# Altium project Keyboard_Bottom.PrjPcb
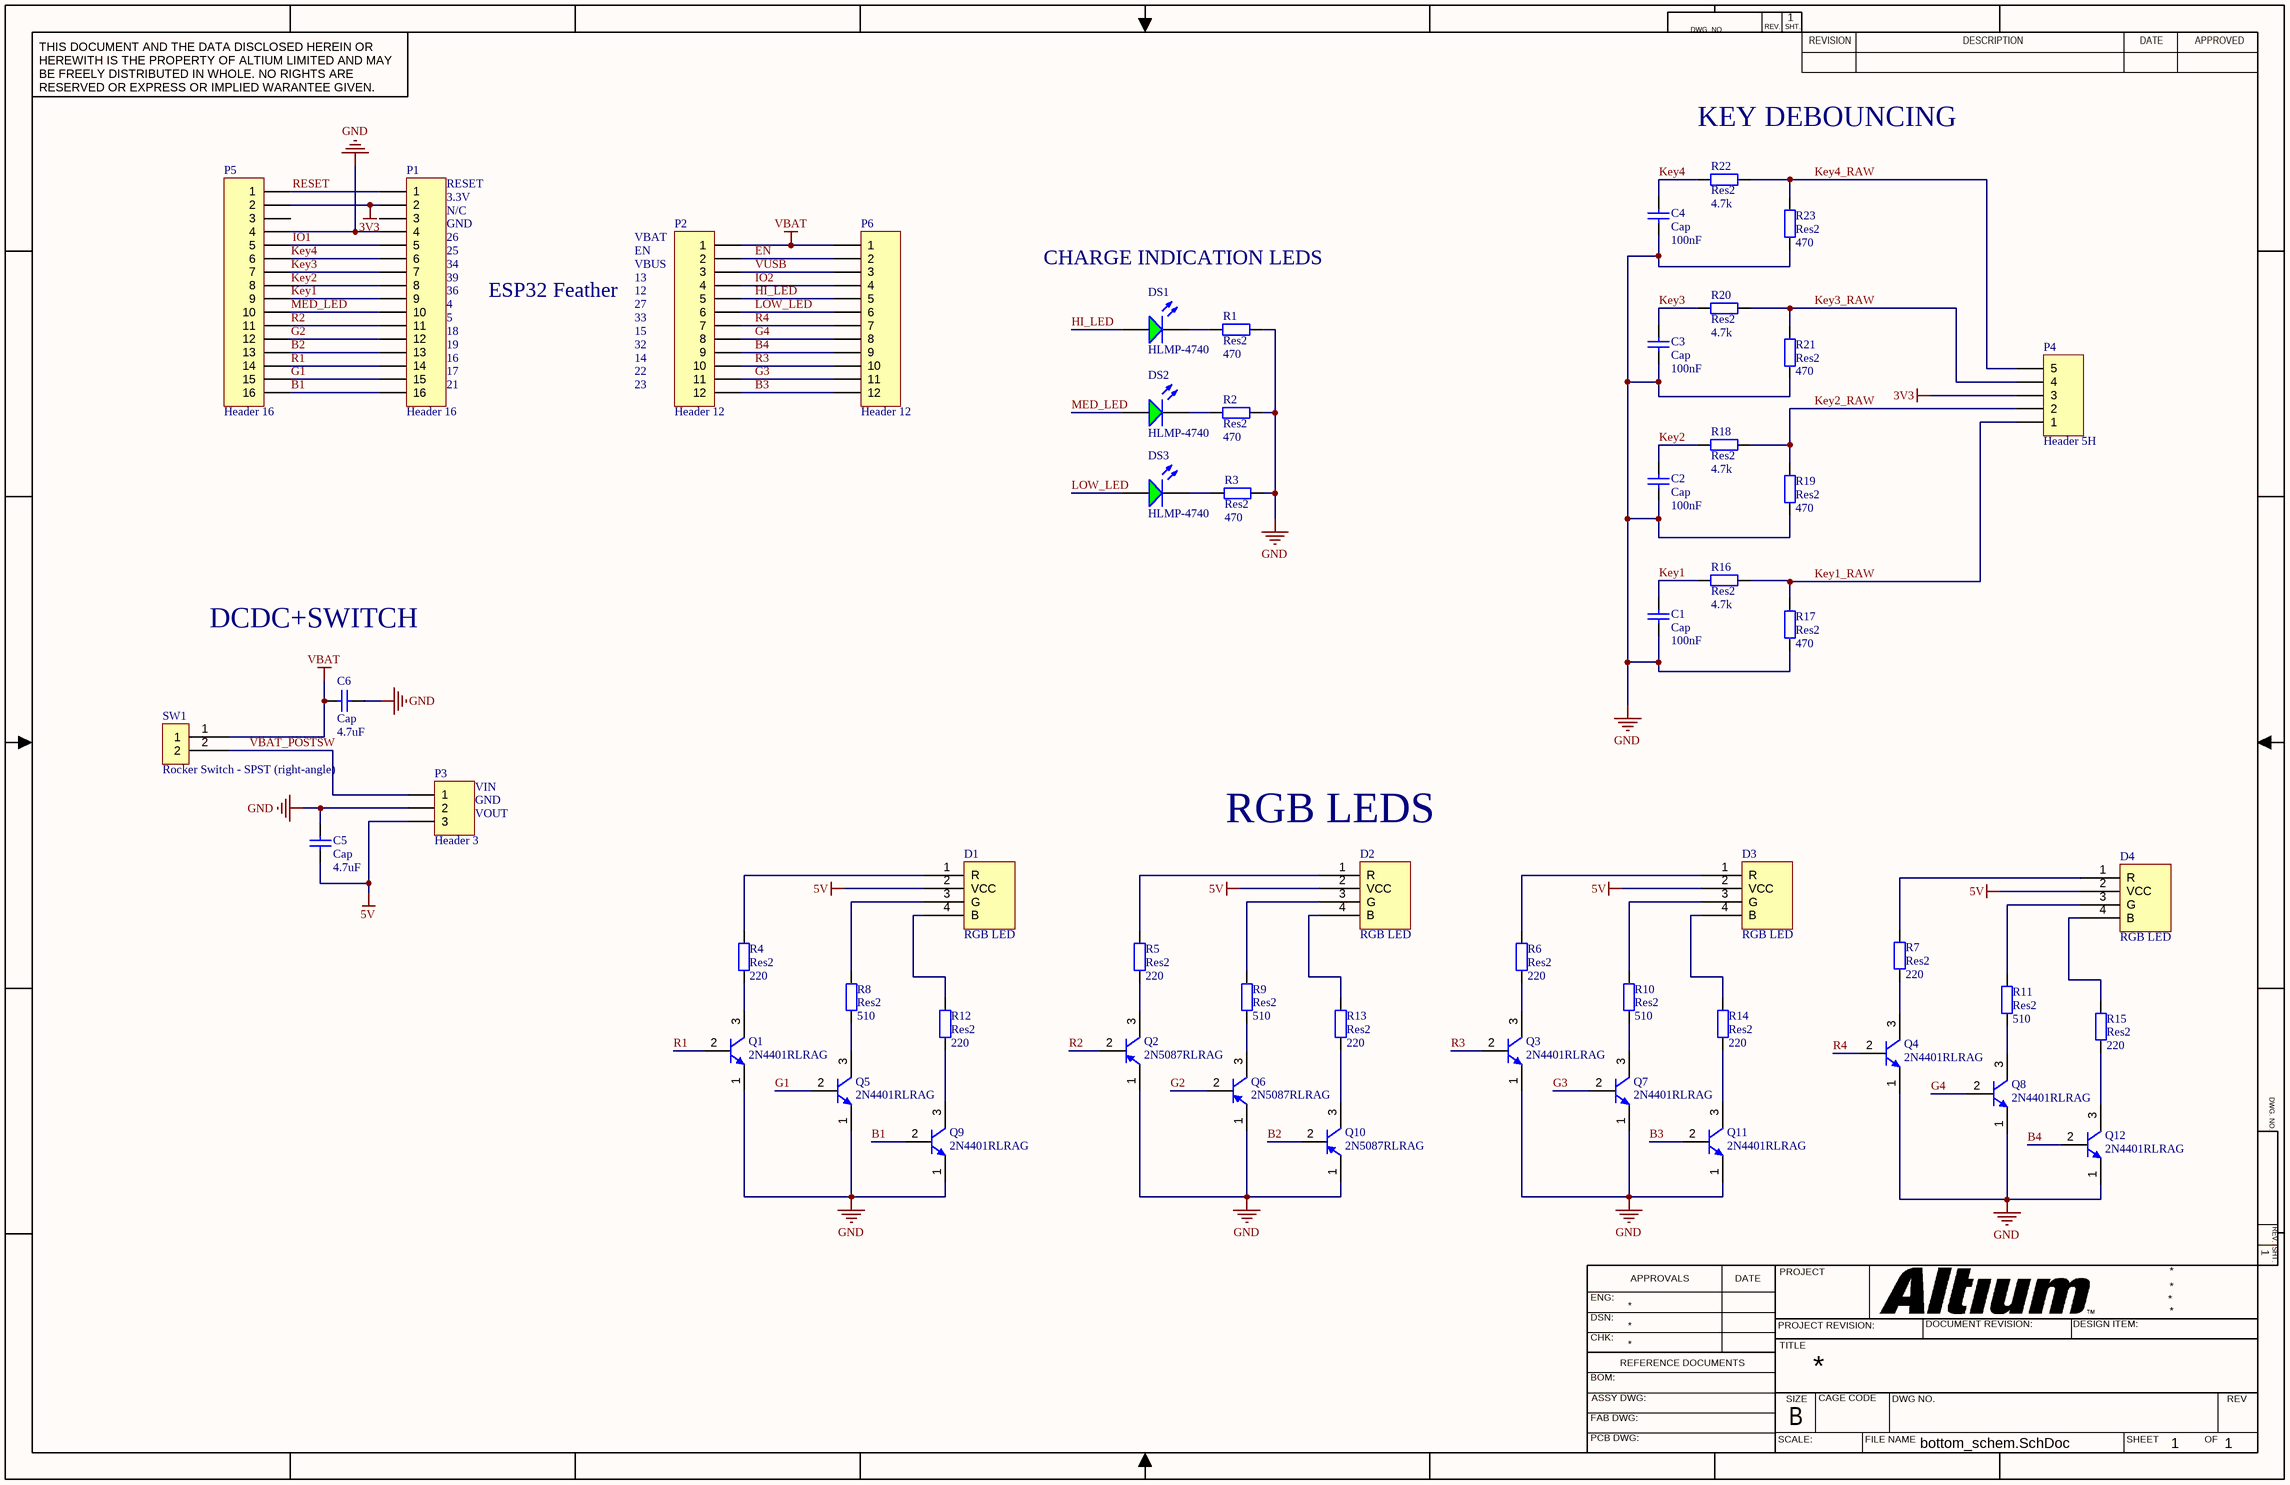
[diagram p0: bottom_schem.SchDoc]
1 sheet, 55 parts. Net scope: global (net labels, ports and power ports of the same name join across sheets).
Board file: bottom_pcb.PcbDoc

## Sheet bottom_schem.SchDoc
size 431 x 279 mm; SheetNumber: 1; SheetTotal: 1; SPICEModelCacheWXNTTEOF: <root> / <DocumentId>WXNTTEOF</DocumentId> / <CacheFrame Number="0"> / <Model Name="led1" Kind="MDL"> / <Text>*Typ RED GaAs LED: Vf=1.7V Vr=4V If=40mA trr=3uS / *LED Pinout: 1=A, 2=K / .MODEL LED1 D (IS=93.2P RS=42M N=3.73 BV=4 IBV=10U / + CJO=2.97P VJ=.75 M=.333 TT=4.32U)</Text> / </Model> / <Model Name="cap" Kind="MDL"> / <Text>*Default semiconductor capacitor / .MODEL CAP C()</Text> / </Model> / </CacheFrame> / </root>

### Parts
C1  Cap  value 100nF  [RAD-0.3]
C2  Cap  value 100nF  [RAD-0.3]
C3  Cap  value 100nF  [RAD-0.3]
C4  Cap  value 100nF  [RAD-0.3]
C5  Cap  value 4.7uF  [RAD-0.3]
C6  Cap  value 4.7uF  [RAD-0.3]
D1  RGB LED  [New footprint 1]
D2  RGB LED  [New footprint 1]
D3  RGB LED  [New footprint 1]
D4  RGB LED  [New footprint 1]
DS1  HLMP-4740  [AVAG-HLMP-4740]
DS2  HLMP-4740  [AVAG-HLMP-4740]
DS3  HLMP-4740  [AVAG-HLMP-4740]
P1  Header 16  [HDR1X16]
P2  Header 12  [HDR1X12]
P3  Header 3  [HDR1X3]
P4  Header 5H  [HDR1X5H]
P5  Header 16  [HDR1X16]
P6  Header 12  [HDR1X12]
Q1  2N4401RLRAG  [ONSC-TO-92-3-29-11_AM_BL]
Q2  2N5087RLRAG  [ONSC-TO-92-3-29-11_AM_BL]
Q3  2N4401RLRAG  [ONSC-TO-92-3-29-11_AM_BL]
Q4  2N4401RLRAG  [ONSC-TO-92-3-29-11_AM_BL]
Q5  2N4401RLRAG  [ONSC-TO-92-3-29-11_AM_BL]
Q6  2N5087RLRAG  [ONSC-TO-92-3-29-11_AM_BL]
Q7  2N4401RLRAG  [ONSC-TO-92-3-29-11_AM_BL]
Q8  2N4401RLRAG  [ONSC-TO-92-3-29-11_AM_BL]
Q9  2N4401RLRAG  [ONSC-TO-92-3-29-11_AM_BL]
Q10  2N5087RLRAG  [ONSC-TO-92-3-29-11_AM_BL]
Q11  2N4401RLRAG  [ONSC-TO-92-3-29-11_AM_BL]
Q12  2N4401RLRAG  [ONSC-TO-92-3-29-11_AM_BL]
R1  Res2  value 470  [AXIAL-0.4]
R2  Res2  value 470  [AXIAL-0.4]
R3  Res2  value 470  [AXIAL-0.4]
R4  Res2  value 220  [AXIAL-0.4]
R5  Res2  value 220  [AXIAL-0.4]
R6  Res2  value 220  [AXIAL-0.4]
R7  Res2  value 220  [AXIAL-0.4]
R8  Res2  value 510  [AXIAL-0.4]
R9  Res2  value 510  [AXIAL-0.4]
R10  Res2  value 510  [AXIAL-0.4]
R11  Res2  value 510  [AXIAL-0.4]
R12  Res2  value 220  [AXIAL-0.4]
R13  Res2  value 220  [AXIAL-0.4]
R14  Res2  value 220  [AXIAL-0.4]
R15  Res2  value 220  [AXIAL-0.4]
R16  Res2  value 4.7k  [AXIAL-0.4]
R17  Res2  value 470  [AXIAL-0.4]
R18  Res2  value 4.7k  [AXIAL-0.4]
R19  Res2  value 470  [AXIAL-0.4]
R20  Res2  value 4.7k  [AXIAL-0.4]
R21  Res2  value 470  [AXIAL-0.4]
R22  Res2  value 4.7k  [AXIAL-0.4]
R23  Res2  value 470  [AXIAL-0.4]
SW1  Rocker Switch - SPST (right-angle)  [Rocker Switch - SPST (right-angle)-Footprint-1]

### Nets
3V3: P1.2 P4.3 P5.2
5V: C5.2 D1.2(VCC) D2.2(VCC) D3.2(VCC) D4.2(VCC) P3.3
GND: C1.2 C2.2 C3.2 C4.2 C5.1 C6.2 P1.4 P3.2 P5.4 Q1.1(E) Q2.1(E) Q3.1(E) Q4.1(E) Q5.1(E) Q6.1(E) Q7.1(E) Q8.1(E) Q9.1(E) Q10.1(E) Q11.1(E) Q12.1(E) R1.1 R2.1 R3.1 R17.1 R19.1 R21.1 R23.1
VBAT: C6.1 P2.1 P6.1 SW1.1
B1: P1.16 P5.16 Q9.2(B)
B2: P1.13 P5.13 Q10.2(B)
B3: P2.12 P6.12 Q11.2(B)
B4: P2.9 P6.9 Q12.2(B)
EN: P2.2 P6.2
G1: P1.15 P5.15 Q5.2(B)
G2: P1.12 P5.12 Q6.2(B)
G3: P2.11 P6.11 Q7.2(B)
G4: P2.8 P6.8 Q8.2(B)
HI_LED: DS1.1(A) P2.5 P6.5
IO1: P1.5 P5.5
IO2: P2.4 P6.4
Key1: C1.1 P1.9 P5.9 R16.2
Key1_RAW: P4.1 R16.1 R17.2
Key2: C2.1 P1.8 P5.8 R18.2
Key2_RAW: P4.2 R18.1 R19.2
Key3: C3.1 P1.7 P5.7 R20.2
Key3_RAW: P4.4 R20.1 R21.2
Key4: C4.1 P1.6 P5.6 R22.2
Key4_RAW: P4.5 R22.1 R23.2
LOW_LED: DS3.1(A) P2.6 P6.6
MED_LED: DS2.1(A) P1.10 P5.10
R1: P1.14 P5.14 Q1.2(B)
R2: P1.11 P5.11 Q2.2(B)
R3: P2.10 P6.10 Q3.2(B)
R4: P2.7 P6.7 Q4.2(B)
RESET: P1.1 P5.1
VBAT_POSTSW: P3.1 SW1.2
VUSB: P2.3 P6.3
NetD1_1: D1.1(R) R4.2
NetD1_3: D1.3(G) R8.2
NetD1_4: D1.4(B) R12.2
NetD2_1: D2.1(R) R5.2
NetD2_3: D2.3(G) R9.2
NetD2_4: D2.4(B) R13.2
NetD3_1: D3.1(R) R6.2
NetD3_3: D3.3(G) R10.2
NetD3_4: D3.4(B) R14.2
NetD4_1: D4.1(R) R7.2
NetD4_3: D4.3(G) R11.2
NetD4_4: D4.4(B) R15.2
NetDS1_2: DS1.2(K) R1.2
NetDS2_2: DS2.2(K) R2.2
NetDS3_2: DS3.2(K) R3.2
NetQ1_3: Q1.3(C) R4.1
NetQ2_3: Q2.3(C) R5.1
NetQ3_3: Q3.3(C) R6.1
NetQ4_3: Q4.3(C) R7.1
NetQ5_3: Q5.3(C) R8.1
NetQ6_3: Q6.3(C) R9.1
NetQ7_3: Q7.3(C) R10.1
NetQ8_3: Q8.3(C) R11.1
NetQ9_3: Q9.3(C) R12.1
NetQ10_3: Q10.3(C) R13.1
NetQ11_3: Q11.3(C) R14.1
NetQ12_3: Q12.3(C) R15.1

Not connected (* = marked no-connect by the designer): P1 3; P5 3

### Notes on the sheet
- (near R22) KEY DEBOUNCING
- (near P1) RESET
- (near P1) 3.3V
- (near P1) N/C
- (near P1) GND
- (near P1) 26
- (near P1) 25
- (near P1) 34
- (near P1) 39
- (near P1) 36
- ESP32 Feather
- VBAT
- EN
- VBUS
- 13
- 12
- CHARGE INDICATION LEDS
- (near P1) 4
- (near P1) 5
- (near P1) 18
- (near P1) 19
- (near P1) 16
- 27
- 33
- 15
- 32
- 14
- (near P1) 17
- (near P1) 21
- 22
- 23
- DCDC+SWITCH
- (near P3) VIN
- (near P3) GND
- (near P3) VOUT
- (near D2) RGB LEDS
- DWG. NO.
- REV.
- SHT.
- THIS DOCUMENT AND THE DATA DISCLOSED HEREIN OR HEREWITH IS THE PROPERTY OF ALTIUM LIMITED AND MAY BE FREELY DISTRIBUTED IN WHOLE. NO RIGHTS ARE RESERVED OR EXPRESS OR IMPLIED WARANTEE GIVEN.
- REVISION
- DESCRIPTION
- DATE
- APPROVED
- ENG:
- APPROVALS
- PROJECT
- DSN:
- CHK:
- REFERENCE DOCUMENTS
- PROJECT REVISION:
- TITLE
- DOCUMENT REVISION:
- DESIGN ITEM:
- BOM:
- FAB DWG:
- PCB DWG:
- ASSY DWG:
- SCALE:
- SIZE
- B
- CAGE CODE
- FILE NAME
- DWG NO.
- SHEET
- OF
- REV

### Library data of the parts
C1-C6 = Cap: Capacitor; Published: 8-Jun-2000; LatestRevisionDate: 17-Jul-2002; LatestRevisionNote: Re-released for DXP Platform.; PackageReference: RAD-0.3; Publisher: Altium Limited; PackageDescription: Radial Cap, Thru-Hole; 2 Leads; 0.3 in Pin Spacing
D1-D4 = CMP-007-00036-1: 4-pin common anode RGB LED
DS1-DS3 = CMP-2000-06413-1: T-1 3/4 (5 mm) Low Current LED Lamp, Green, 1.9 V, -20 to 100 degC, 2-Pin THD, RoHS, Bulk; Manufacturer: AvagoTechnologies; Type: Uni-Color; Peak Wavelength: 565nm; Rad Hard: No; Viewing Angle: 50°; Dominant Wavelength/Color Temperature: 569nm; Number of LEDs: 1; Lens Appearance: ColoredDiffused; Lens Shape Type: Circular; Mounting Orientation: TopMount; Intensity: 2.3mcd; Datasheet Version: 07/2014; Category: LEDs; Datasheet URL: http://docs.avagotech.com/docs/AV02-1557EN; Packaging: Bulk; Pin Count: 2; Mounting Technology: ThroughHole; Package Reference: HLMP-4740; Mounting: ThroughHole; Manufacturer URL: http://www.avagotech.com/; Color: Green; Package: 2T-13/4; Package Description: 2-Pin Through Hole Device, Dia 5.845 mm, Pitch 2.54 mm
P1 P5 = Header 16: Header, 16-Pin; LatestRevisionDate: 17-Jul-2002; LatestRevisionNote: Re-released for DXP Platform.; Publisher: Altium Limited
P2 P6 = Header 12: Header, 12-Pin; LatestRevisionDate: 17-Jul-2002; LatestRevisionNote: Re-released for DXP Platform.; Publisher: Altium Limited
P3 = Header 3: Header, 3-Pin; LatestRevisionDate: 17-Jul-2002; LatestRevisionNote: Re-released for DXP Platform.; Publisher: Altium Limited
P4 = Header 5H: Header, 5-Pin, Right Angle; LatestRevisionDate: 17-Jul-2002; LatestRevisionNote: Re-released for DXP Platform.; Publisher: Altium Limited
Q1 Q3-Q5 Q7-Q9 Q11 Q12 = CMP-1048-01482-1: General Purpose Transistor, NPN Silicon, 3-Pin TO-92, Pb-Free, Tape and Reel; Manufacturer: On Semiconductor; IC Continuous (A): 0.6; fT Min (MHz): 250; PackageDescription: 3-Pin Transistor Outline, Body 4.825 x 3.685 mm, Pitch 1.27 mm; ComponentLink1Description: Manufacturer URL; Packing: Tape and Reel; ComponentLink1URL: http://www.onsemi.com/; PackageVersion: Rev. AM; ComponentLink3URL: http://www.onsemi.com/pub_link/Collateral/MAC97-D.PDF; PackageReference: TO-92-3-29-11_AM_BL; ComponentLink3Description: Package Specification; DatasheetVersion: Rev. 4; ComponentLink2Description: Datasheet; PartNumber: 2N4401RLRAG; Polarity: NPN; Mounting Technology: Through Hole; RoHS: TRUE; ComponentLink2URL: http://www.onsemi.com/pub_link/Collateral/2N4401-D.PDF
Q2 Q6 Q10 = CMP-1048-01483-1: Amplifier Transistor, PNP Silicon, 3-Pin TO-92, Pb-Free, Tape and Reel; Manufacturer: On Semiconductor; fT Min (MHz): 40; IC Continuous (A): 0.05; ComponentLink1Description: Manufacturer URL; Packing: Tape and Reel; PackageDescription: 3-Pin Transistor Outline, Body 4.825 x 3.685 mm, Pitch 1.27 mm; ComponentLink3URL: http://www.onsemi.com/pub_link/Collateral/MAC97-D.PDF; RoHS: TRUE; ComponentLink2URL: http://www.onsemi.com/pub_link/Collateral/2N5087-D.PDF; PackageVersion: Rev. AM; Mounting Technology: Through Hole; Polarity: PNP; PartNumber: 2N5087RLRAG; DatasheetVersion: Rev. 5; ComponentLink1URL: http://www.onsemi.com/; ComponentLink2Description: Datasheet; ComponentLink3Description: Package Specification; PackageReference: TO-92-3-29-11_AM_BL
R1-R23 = Res2: Resistor; Published: 8-Jun-2000; LatestRevisionDate: 17-Jul-2002; LatestRevisionNote: Re-released for DXP Platform.; PackageReference: AXIAL-0.4; Publisher: Altium Limited; PackageDescription: Axial Device, Thru-Hole; 2 Leads; 0.4 in Pin Spacing
SW1 = CMP-011-00016-1: Rated up to 15A @ 125V